# Altium schematic sheet Nano_1.SchDoc
size 368 x 289 mm
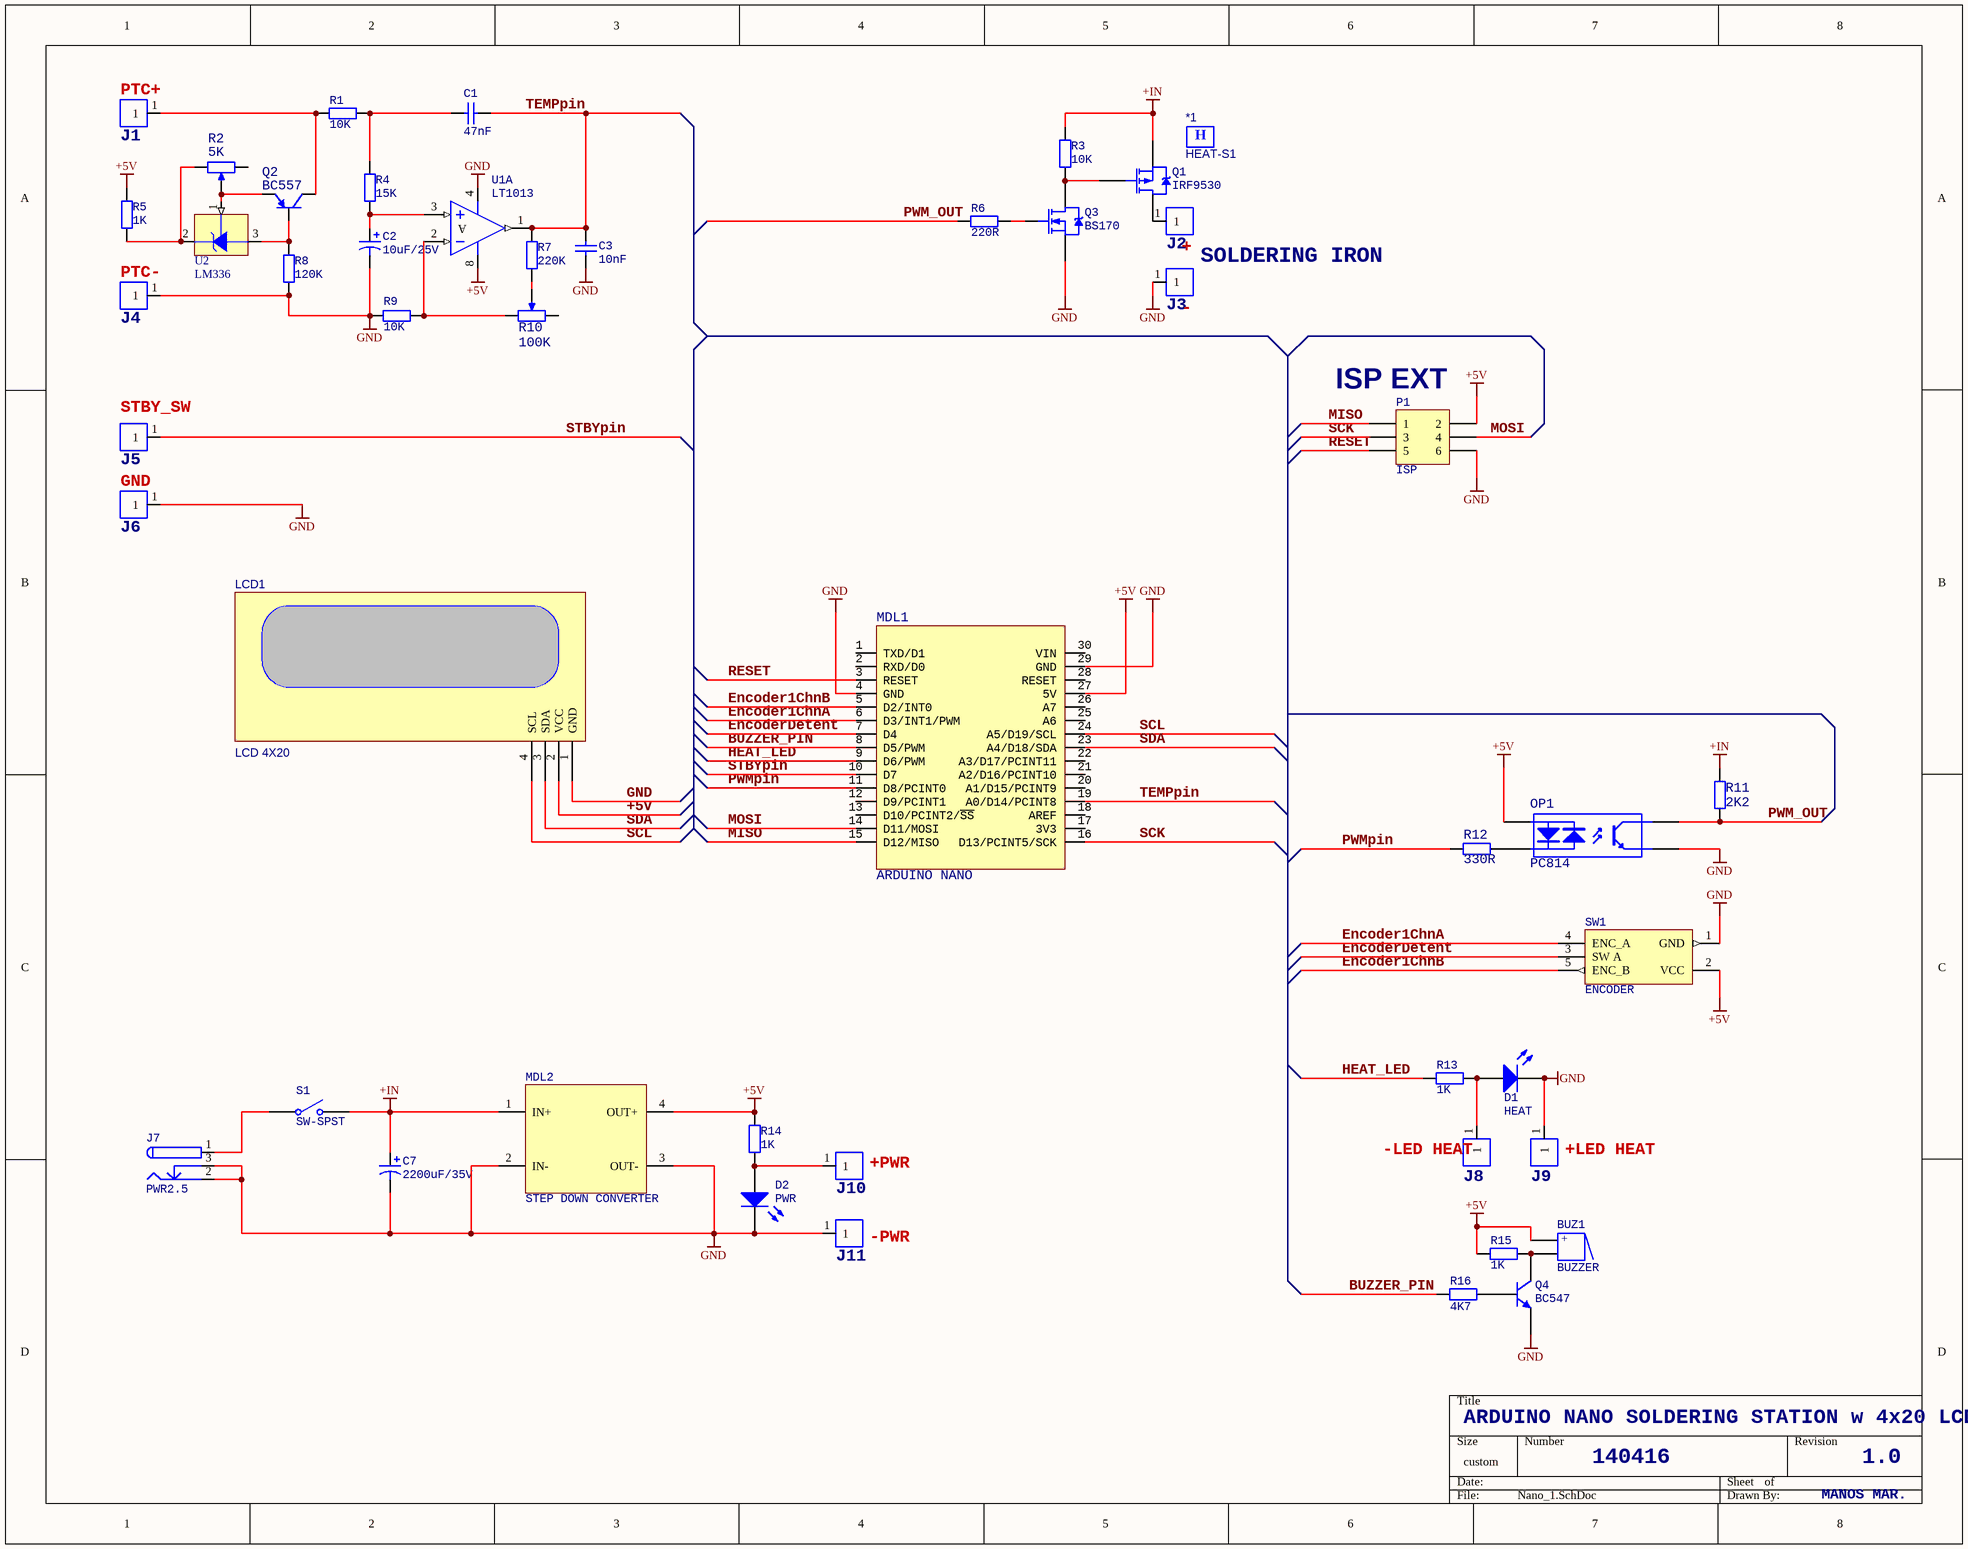
[diagram p0: Nano_1.SchDoc]

## Parts
*1  HEAT-S1  [SK 104 HEATSHINK]
BUZ1  BUZZER  [BUZZER]
C1  47nF  [RAD0.2]
C2  10uF/25V  [RB-08]
C3  10nF  [RAD0.2]
C7  2200uF/35V  [RB5-10.5]
D1  HEAT  [LED0.3]
D2  PWR  [LED0.3]
J1  PTC+  [CON2]
J2  +  [CON2]
J3  -  [CON2]
J4  PTC-  [CON2]
J5  STBY_SW  [CON2]
J6  GND  [CON2]
J7  PWR2.5  [POWER JACK]
J8  -LED HEAT  [CON2]
J9  +LED HEAT  [CON2]
J10  +PWR  [CON2]
J11  -PWR  [CON2]
LCD1  value LCD 4X20  [HDR1X4]  (hidden comment: LCD 4x20 SERIAL)
MDL1  ARDUINO NANO  [ARDUINO NANO]
MDL2  STEP DOWN CONVERTER  [STEP DOWN CONVERTER MINI]
OP1  PC814  [DIP-4]
P1  ISP  [HDR2X3]
Q1  IRF9530  [TO-220V]
Q2  BC557  [T0-92]
Q3  BS170  [T0-92]
Q4  BC547  [T0-92]
R1  10K  [AXIAL0.4]
R2  5K  [VR6]
R3  10K  [AXIAL0.4]
R4  15K  [AXIAL0.4]
R5  1K  [AXIAL0.4]
R6  220R  [AXIAL0.4]
R7  220K  [AXIAL0.4]
R8  120K  [AXIAL0.4]
R9  10K  [AXIAL0.4]
R10  100K  [VR6]
R11  2K2  [AXIAL0.4]
R12  330R  [AXIAL0.4]
R13  1K  [AXIAL0.4]
R14  1K  [AXIAL0.4]
R15  1K  [AXIAL0.4]
R16  4K7  [AXIAL0.4]
S1  SW-SPST  [SPST-2]
SW1  ENCODER  [HDR1X5]
U1  LT1013  [DIP-8]  (part A of 2)
U2  LM336  [Z03A]

## Nets
+5V: BUZ1.1 LCD1.2(VCC) MDL1.27(5V) MDL2.4(OUT+) OP1.1(A) P1.2 R5.2 R14.2 R15.2 SW1.2(VCC) U1.8(V+)
+IN: C7.1 MDL2.1(IN+) Q1.3(S) R3.2 R11.1 S1.2(NO)
GND: C2.2 C3.1 C7.2 D1.2(K) D2.2(K) J3.1 J4.1 J6.1 J7.2 J7.3 J9.1 J11.1 LCD1.1(GND) MDL1.4(GND) MDL1.29(GND) MDL2.2(IN-) MDL2.3(OUT-) OP1.3(E) P1.6 Q3.3(S) Q4.2(E) R8.1 R9.2 SW1.1(GND) U1.4(V-)
BUZZER_PIN: MDL1.8(D5/PWM) R16.1
Encoder1ChnA: MDL1.6(D3/INT1/PWM) SW1.4(ENC_A)
Encoder1ChnB: MDL1.5(D2/INT0) SW1.5(ENC_B)
EncoderDetent: MDL1.7(D4) SW1.3(SW_A)
HEAT_LED: MDL1.9(D6/PWM) R13.1
MISO: MDL1.15(D12/MISO) P1.1
MOSI: MDL1.14(D11/MOSI) P1.4
PWM_OUT: OP1.4(C) R6.1 R11.2
PWMpin: MDL1.11(D8/PCINT0) R12.2
RESET: MDL1.3(RESET) P1.5
SCK: MDL1.16(D13/PCINT5/SCK) P1.3
SCL: LCD1.4(SCL) MDL1.24(A5/D19/SCL)
SDA: LCD1.3(SDA) MDL1.23(A4/D18/SDA)
STBYpin: J5.1 MDL1.10(D7)
TEMPpin: C1.1 C3.2 MDL1.19(A0/D14/PCINT8) R7.1 U1.1(OUT)
NetBUZ1_2: BUZ1.2 Q4.3(C) R15.1
NetC1_2: C1.2 R1.2 R4.1
NetC2_1: C2.1 R4.2 U1.3(IN+)
NetD1_1: D1.1(A) J8.1 R13.2
NetD2_1: D2.1(A) J10.1 R14.1
NetJ1_1: J1.1 Q2.3(C) R1.1
NetJ2_1: J2.1 Q1.2(D)
NetJ7_1: J7.1 S1.1(COMMON)
NetOP1_2: OP1.2(K) R12.1
NetQ1_1: Q1.1(G) Q3.2(D) R3.1
NetQ2_1: Q2.1(B) R8.2 U2.3(-V)
NetQ2_2: Q2.2(E) R2.2(TAP) U2.1(ADJ)
NetQ3_1: Q3.1(G) R6.2
NetQ4_1: Q4.1(B) R16.2
NetR2_1: R2.1(TOP) R5.1 U2.2(+V)
NetR7_2: R7.2 R10.2(TAP)
NetR9_1: R9.1 R10.1(BOT) U1.2(IN-)

Not connected (* = marked no-connect by the designer): MDL1 1(TXD/D1) 2(RXD/D0) 12(D9/PCINT1) 13(D10/PCINT2/~{SS}) 17(3V3) 18(AREF) 20(A1/D15/PCINT9) 21(A2/D16/PCINT10) 22(A3/D17/PCINT11) 25(A6) 26(A7) 28(RESET) 30(VIN); R2 3(BOT); R10 3(TOP)

## Notes on the sheet
- SOLDERING IRON
- (near P1) ISP EXT
- ARDUINO NANO SOLDERING STATION w 4x20 LCD
- 140416
- MANOS MAR.
- 1.0
- (in symbol BUZZER) +
- (in symbol HEAT-S1) H
- (in symbol LT1013ACJ8, part A) A

## Library data of the parts
C1 C3 = D-101-0085: Capacitor, Ceramic, 4.7uF 10% 16V 0805 (2012) X7R; Polarity: Non-Polarized; Capacitance: 4.7 uF; Dielectric: X7R; Mounting Technology: Surface Mount; Rated Voltage: 16 V; Status: Unreleased; Technology: None; Tolerance: 10 %; Category: Capacitor
C2 C7 = Cap Pol1: Polarized Capacitor (Radial); Value: 100pF; Published: 8-Jun-2000; LatestRevisionDate: 17-Jul-2002; LatestRevisionNote: Re-released for DXP Platform.; PackageReference: RB7.6-15; Publisher: Altium Limited; PackageDescription: Polarized Capacitor (Radial); 2 Leads
D1 D2 = LED0: Typical INFRARED GaAs LED; Published: 8-Jun-2000; LatestRevisionDate: 08-Jul-2005; LatestRevisionNote: Mech Layer 1 removed.; PackageReference: LED-0; Publisher: Altium Limited; PackageDescription: LED; 2 Leads
J1-J6 J8-J11 = CON1_S: Manufacturer: Sta.Ge HELLAS
J7 = PWR2.5: Low Voltage Power Supply Connector; Published: 17-Dec-2003; DatasheetDocument: 09-May-2002; Publisher: Altium Limited; ComponentLink1Description: Manufacturer Link; ComponentLink1URL: http://domino.kycon.com/internet/Products.html
LCD1 = LCD4X20
OP1 = OPTO-AC1: AC OPTOCUPLER
P1 = Header 3X2: Header, 3-Pin, Dual row; LatestRevisionDate: 17-Jul-2002; LatestRevisionNote: Re-released for DXP Platform.; Publisher: Altium Limited
Q1 = PMOS-2: P-Channel Power MOSFET; Note: Pin 4 not drawn and electrically connected to Pin 2.; Published: 8-Jun-2000; LatestRevisionDate: 17-Jul-2002; LatestRevisionNote: Re-released for DXP Platform.; DatasheetVersion: PD-9.390D; PackageVersion: Feb-1997; PackageReference: TO-220AB; Publisher: Altium Limited; PackageDescription: TO, Thru-Hole, Vertical, Heatsink Mounted; 3 In-Line Leads; Pitch 2.54 mm; ComponentLink1Description: Manufacturer Link; ComponentLink1URL: http://www.irf.com/
Q2 = PNP: PNP Bipolar Transistor; Published: 8-Jun-2000; LatestRevisionDate: 17-Jul-2002; LatestRevisionNote: Re-released for DXP Platform.; PackageReference: SOT-23B; Publisher: Altium Limited; Code_JEDEC: SOT-23
Q3 = NMOS-2: N-Channel Power MOSFET; Note: Pin 2 is electrically connected to pin 4.; Published: 8-Jun-2000; LatestRevisionDate: 17-Jul-2002; LatestRevisionNote: Re-released for DXP Platform.; DatasheetVersion: PD-9.814; PackageVersion: Feb-1997; PackageReference: TO-220AB; Publisher: Altium Limited; PackageDescription: TO, Thru-Hole, Vertical, Heatsink Mounted; 3 In-Line Leads; Pitch 2.54 mm; ComponentLink1Description: Manufacturer Link; ComponentLink1URL: http://www.irf.com/
Q4 = NPN: NPN Bipolar Transistor; Published: 8-Jun-2000; LatestRevisionDate: 17-Jul-2002; LatestRevisionNote: Re-released for DXP Platform.; PackageReference: TO-226; Publisher: Altium Limited; Code_JEDEC: TO-226-AA
R1 R4 R5 R7-R9 R11 R12 R15 R16 = RES: Manufacturer: Generic Components; SGPartNumber: R001051; Value: 5,6Kohm; Class I: Passive; Class II: Resistor; Power: 0,2W; Type1: SMD; Type2: MG; Tolerance: 5%; Revision: July-2002: Re-released for DXP Platform.; Published: 8-Jun-2000; Publisher: Altium Limited; Package: 1206; Packaging: TAPE & REEL (TR); Resistance: 5,6KOhm
R2 R10 = RPot2: Manufacturer: Sta.Ge HELLAS; SGPartnumber: R001049; Part Number: R002107; Value: 10KOhm; Class I: Passive; Class II: Potentiometer; Power: NU; Tolerance: 10%; Type1: TH; Type3: TRIMMER; Revision: 11-05; Published: 8-Jun-2000; Publisher: Altium Limited; Type: Metal Film; Type2: NU; Resistance: 10KOhm
R3 R6 = Res2: Resistor; Value: 1K; Published: 8-Jun-2000; LatestRevisionDate: 17-Jul-2002; LatestRevisionNote: Re-released for DXP Platform.; PackageReference: AXIAL-0.4; Publisher: Altium Limited; PackageDescription: Axial Device, Thru-Hole; 2 Leads; 0.4 in Pin Spacing
R13 R14 = Res2: Resistor; Published: 8-Jun-2000; LatestRevisionDate: 17-Jul-2002; LatestRevisionNote: Re-released for DXP Platform.; PackageReference: AXIAL-0.4; Publisher: Altium Limited; PackageDescription: Axial Device, Thru-Hole; 2 Leads; 0.4 in Pin Spacing; Value: 1K
S1 = SW-SPST: Single-Pole, Single-Throw Switch; Published: 24-Mar-1999; LatestRevisionDate: 17-Jul-2002; LatestRevisionNote: Re-released for DXP Platform.; PackageReference: SPST-2; Publisher: Altium Limited; PackageDescription: Switch; 2 Leads
SW1 = ROTARY ENC
U1 = LT1013ACJ8: Dual Precision Operational Amplifier; Note: 190; Published: 8-Jun-2000; LatestRevisionDate: 29-May-2009; LatestRevisionNote: Component Body Added.; DatasheetVersion: Jan-1996; PackageVersion: J8 0801; PackageReference: J8; Publisher: Altium Limited; PackageDescription: DIP, Ceramic, 8-Pin, Row Spacing 7.62 mm, Pitch 2.54 mm; ComponentLink1Description: Manufacturer Link; ComponentLink1URL: http://www.linear.com/; ComponentLink2Description: Datasheet; ComponentLink2URL: http://www.linear.com/pc/downloadDocument.do?navId=H0,C1,C1154,C1009,C1021,P1223,D3743
U2 = LM385Z: Adjustable Micropower Voltage Reference; Published: 15-Apr-2002; DatasheetVersion: Jun-1999; PackageVersion: 2000; PackageReference: Z03A; Publisher: Altium Limited; PackageDescription: TO, Flat Index; 3 In-Line, Axial Leads; Body Dia. 4.6mm; Leads 0.53 x 0.39 mm (max); ComponentLink1Description: Manufacturer Link; ComponentLink1URL: http://www.national.com/; ComponentLink2Description: Datasheet; ComponentLink2URL: http://www.national.com/ds.cgi/LM/LM185-ADJ.pdf; ComponentLink3Description: URL Link1; ComponentLink3URL: http://www.national.com/pf/LM/LM385-ADJ.html